# Altium project transmitter-d.PrjPcb
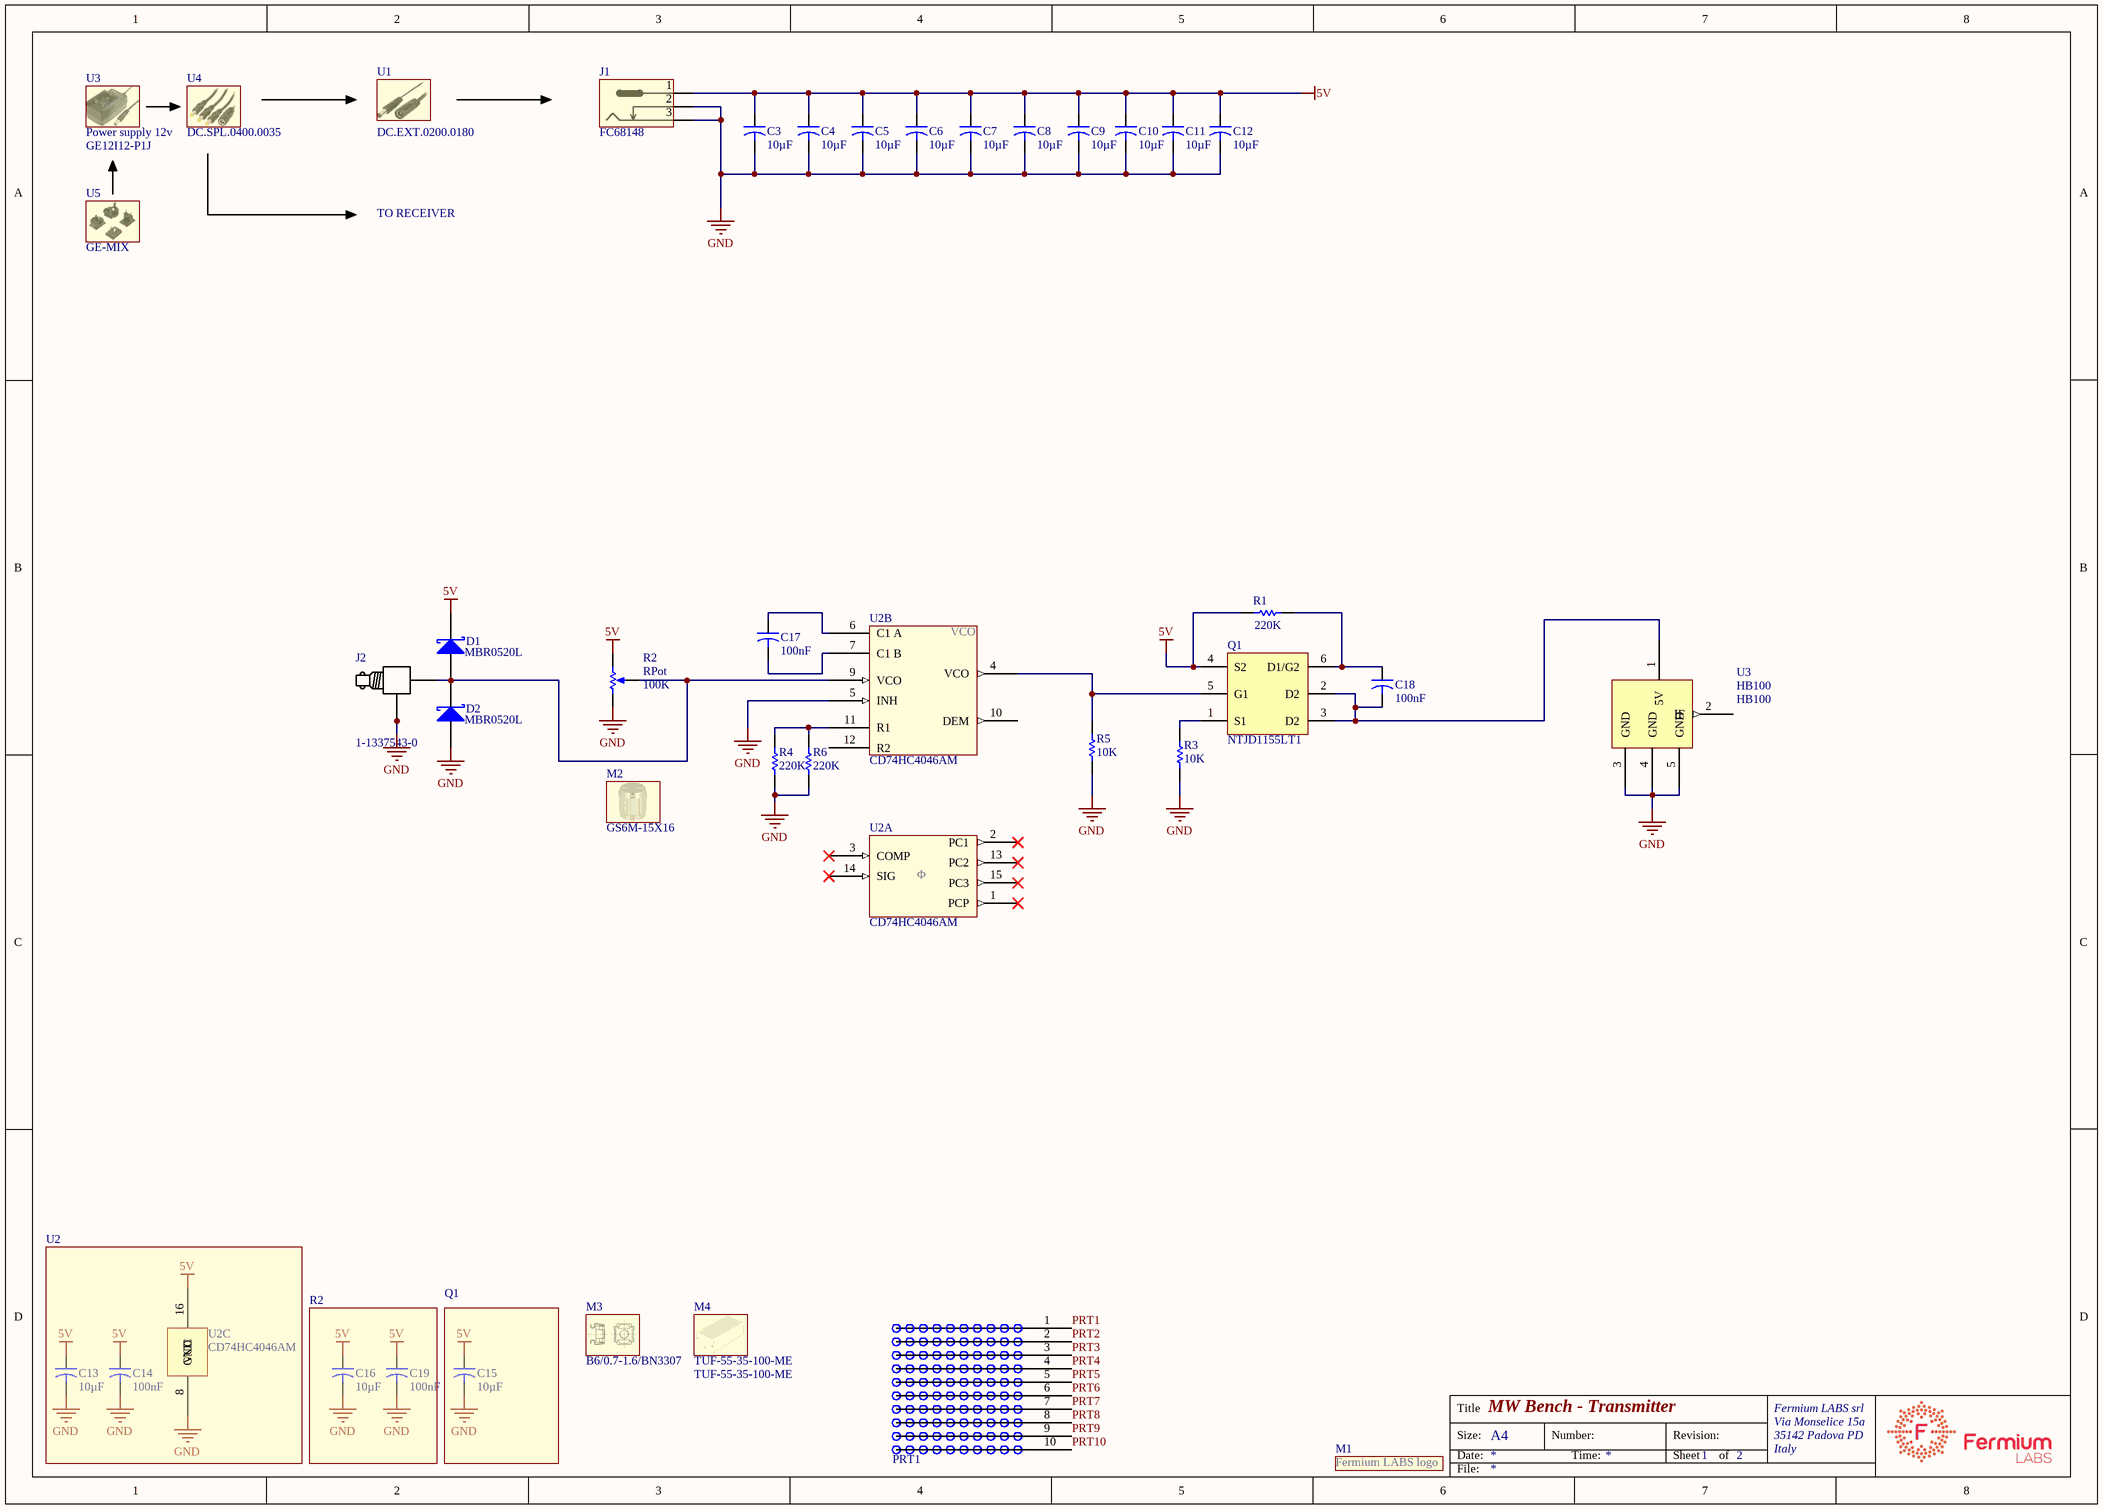
[diagram p0: transmitter-d.SchDoc]
1 sheet, 39 parts. Net scope: global (net labels, ports and power ports of the same name join across sheets).
Board file: transmitter-d.PcbDoc

## Sheet transmitter-d.SchDoc: MW Bench - Transmitter
size A3; Organization: Altium Limited; Address1: L3, 12a Rodborough Rd; Address2: Frenchs Forest; Address3: NSW; Address4: Australia 2086; SheetNumber: 1; SheetTotal: 2

### Parts
(Parts that share a designator on the sheet are numbered #1, #2 ... from top to bottom, then left to right.)
C3  Capacitance: 10µF  [CAP 1206/3216]
C4  Capacitance: 10µF  [CAP 1206/3216]
C5  Capacitance: 10µF  [CAP 1206/3216]
C6  Capacitance: 10µF  [CAP 1206/3216]
C7  Capacitance: 10µF  [CAP 1206/3216]
C8  Capacitance: 10µF  [CAP 1206/3216]
C9  Capacitance: 10µF  [CAP 1206/3216]
C10  Capacitance: 10µF  [CAP 1206/3216]
C11  Capacitance: 10µF  [CAP 1206/3216]
C12  Capacitance: 10µF  [CAP 1206/3216]
C13  Capacitance: 10µF  [CAP 1206/3216]
C14  Capacitance: 100nF  [CAP 0805/2012]
C15  Capacitance: 10µF  [CAP 1206/3216]
C16  Capacitance: 10µF  [CAP 1206/3216]
C17  Capacitance: 100nF  [CAP 0805/2012]
C18  Capacitance: 100nF  [CAP 0805/2012]
C19  Capacitance: 100nF  [CAP 0805/2012]
D1  Supplier Part Number 1: MBR0520L  [SOD123]
D2  Supplier Part Number 1: MBR0520L  [SOD123]
J1  Supplier Part Number 1: FC68148  [dc-jack]  (no BOM)
J2  Supplier Part Number 1: 1-1337543-0  [BNC-RA]
M1  fermiumlabs-logo  [frm-med]  (value not drawn)  (no BOM)
M2  knob  (value not drawn)  (mechanical)
M3  B6/0.7-1.6/BN3307  (mechanical)
M4  TUF-55-35-100-ME
PRT1  protoboard  [protoboard-half-inch]  (value not drawn)  (no BOM)
Q1  NTJD1155LT1  [ONSC-SC70-6-419B-02_W_V]
R1  value 220K  [RES 0805/2012]  (hidden comment: Res1)
R2  RPot  value 100K  [R16148-1A]
R3  value 10K  [RES 0805/2012]  (hidden comment: Res1)
R4  value 220K  [RES 0805/2012]  (hidden comment: Res1)
R5  value 10K  [RES 0805/2012]  (hidden comment: Res1)
R6  value 220K  [RES 0805/2012]  (hidden comment: Res1)
U1  DC.EXT.0200.0180  (mechanical)
U2  CD74HC4046AM  [SOIC16]  (parts A,B,C of 3)
U3#1  Power supply 12v  (mechanical)
U3#2  HB100  [HB100-buried]
U4  DC.SPL.0400.0035  (mechanical)
U5  Worldwide plugs for power supply  (value not drawn)  (mechanical)

### Blocks framed on the sheet
U2: C13 C14 U2
R2: C16 C19
Q1: C15

### Nets
5V: C3.1 C4.1 C5.1 C6.1 C7.1 C8.1 C9.1 C10.1 C11.1 C12.1 C13.1 C14.1 C15.1 C16.1 C19.1 D1.K J1.1 Q1.4(S2) R1.1 R2.2(BOT) U2.16(VCC)
GND: C3.2 C4.2 C5.2 C6.2 C7.2 C8.2 C9.2 C10.2 C11.2 C12.2 C13.2 C14.2 C15.2 C16.2 C19.2 D2.A J1.2 J1.3 J2.2(gnd) J2.A J2.B R2.1(TOP) R3.2 R4.1 R5.2 R6.1 U2.5(INH) U2.8(GND) U3#2.3(GND) U3#2.4(GND) U3#2.5(GND)
PRT1: PRT1.1
PRT2: PRT1.2
PRT3: PRT1.3
PRT4: PRT1.4
PRT5: PRT1.5
PRT6: PRT1.6
PRT7: PRT1.7
PRT8: PRT1.8
PRT9: PRT1.9
PRT10: PRT1.10
NetC17_1: C17.1 U2.6(C1_A)
NetC17_2: C17.2 U2.7(C1_B)
NetC18_1: C18.1 Q1.6(D1/G2) R1.2
NetC18_2: C18.2 Q1.2(D2) Q1.3(D2) U3#2.1(5V)
NetD1_A: D1.A D2.K J2.1 R2.3(TAP) U2.9(VCO)
NetQ1_1: Q1.1(S1) R3.1
NetQ1_5: Q1.5(G1) R5.1 U2.4(VCO)
NetR4_2: R4.2 R6.2 U2.11(R1)

Not connected (* = marked no-connect by the designer): U2 1(PCP)* 2(PC1)* 3(COMP)* 10(DEM) 12(R2) 13(PC2)* 14(SIG)* 15(PC3)*; U3#2 2(IF)

### Notes on the sheet
- TO RECEIVER
- Title
- Size:
- Date:
- A4
- Number:
- Time:
- Revision:
- Sheet
- of
- Fermium LABS srl
- Via Monselice 15a
- 35142 Padova PD
- Italy
- File:
- (in symbol CD74HC4046AM, part A) Φ
- (in symbol fermiumlabs-logo) Fermium LABS logo

### Library data of the parts
C3-C13 C15 C16 = Cap2: Capacitor; Manufacturer: SAMSUNG; Manufacturer Part Number: CL31A106KAHNNNE; Unit: pcs; SuppliedAmount: 0; MinAmount: 100; Capacitor type: ceramic; Capacitor kind: MLCC; Operating voltage: 25V; Dielectric: X5R; Tolerance: ±10%; Case - inch: 1206; Case - mm: 3216; Pads: 2 SMD; Published: 23-Sep-2002; PackageReference: CAPR5-4X5; Publisher: Altium Limited; PackageDescription: 1206; Supplier 1: TME; Supplier Part Number 1: CL31A106KAHNNNE; Category: 1206 MLCC SMD Capacitors; Stock 1: 279700; Pricing 1: 100=0.0248, 300=0.0203, 1000=0.0167, 2000=0.0131, 10000=0.0127 (EUR); Weight: 0.061; Multiples: 100; Mounting: SMD; Operating temperature: -55...85°C; Price Type: NET; ComponentLink1URL: http://static.tme.eu/products_pics/b/e/9/be9e0dd298dcf4979ea1dd3d226e0bfa/58780.jpg; ComponentLink1Description: http://static.tme.eu/products_pics/b/e/9/be9e0dd298dcf4979ea1dd3d226e0bfa/58780.jpg
C14 C17-C19 = Cap2: Capacitor; Manufacturer: YAGEO; Manufacturer Part Number: CC0805JRX7R9BB104; Unit: pcs; SuppliedAmount: 0; MinAmount: 100; Capacitor type: ceramic; Capacitor kind: MLCC; Operating voltage: 50V; Dielectric: X7R; Tolerance: ±5%; Case - inch: 0805; Case - mm: 2012; Pads: 2 SMD; Supplier 1: TME; Supplier Part Number 1: CC0805JRX7R9104; Category: 0805 MLCC SMD Capacitors; Stock 1: 89911; Pricing 1: 100=0.00613, 300=0.00464, 1000=0.00342, 4000=0.00284, 20000=0.00273 (EUR); Weight: 0.042; Multiples: 100; Mounting: SMD; Price Type: NET; ComponentLink1URL: http://static.tme.eu/products_pics/d/b/b/dbbd93eaf25225110ca26eb66da77328/58538.jpg; ComponentLink1Description: http://static.tme.eu/products_pics/d/b/b/dbbd93eaf25225110ca26eb66da77328/58538.jpg
D1 D2 = D Schottky: Schottky Diode; Manufacturer: FAIRCHILD SEMICONDUCTOR; Unit: pcs; SuppliedAmount: 0; MinAmount: 10; Multiples: 1; Diode type: Schottky rectifying; Off state voltage max.: 20V; Forward voltage at If: 390mV; Load current: 500mA; Pads: 2 SMD; Published: 8-Jun-2000; LatestRevisionDate: 17-Jul-2002; LatestRevisionNote: Re-released for DXP Platform.; PackageReference: SMB; Publisher: Altium Limited; PackageDescription: DO-214-AA/SMB; 2 C-Bend Leads; Body 5.3 x 3.6 mm, inc. leads (LxW); Code_JEDEC: DO-214-AA; Supplier 1: TME; Manufacturer Part Number: MBR0520L; Category: SMD Schottky Diodes; Stock 1: 24595; Pricing 1: 10=0.0403, 50=0.0376, 250=0.0333, 1000=0.03, 3000=0.0281 (EUR); Weight: 0.032; Case: SOD123; Mounting: SMD; Price Type: NET; ComponentLink1URL: http://static.tme.eu/products_pics/e/d/b/edbd030cb344fc64745afa0f91101952/285567.jpg; ComponentLink1Description: http://static.tme.eu/products_pics/e/d/b/edbd030cb344fc64745afa0f91101952/285567.jpg
J1 = jackdc: Manufacturer: CLIFF; Manufacturer Part Number: DC-10A FC68148; Unit: pcs; SuppliedAmount: 0; MinAmount: 1; Connector: socket; Connector type: DC supply; Contact size: 5,5/2,1mm; Plug outside diameter: 5.5mm; Plug inside diameter: 2.1mm; Connector variant: with on/off switch; Electrical mounting: soldering; Rated current: 5A; Rated voltage: 12V DC; Spatial orientation: angled 90°; Pads: 3 THT; Supplier 1: TME; Category: DC power connectors; Stock 1: 20287; Pricing 1: 1=0.4194, 20=0.3065, 100=0.2581, 500=0.2258 (USD); Weight: 1.733; Multiples: 1; Package type: in bulk; Price Type: NET; ComponentLink1URL: http://static.tme.eu/products_pics/f/8/e/f8eb2e1bea4ffe6692f5958f8ef9edd4/323250.jpg; ComponentLink1Description: http://static.tme.eu/products_pics/f/8/e/f8eb2e1bea4ffe6692f5958f8ef9edd4/323250.jpg
J2 = BNC-PCB-RA: connector bnc; Manufacturer: TE CONNECTIVITY; Unit: pcs; SuppliedAmount: 0; MinAmount: 1; Connector: socket; Connector variant: insulated; Spatial orientation: angled 90°; Wave impedance: 50Ω; Electrical mounting: THT; Mechanical mounting: on PCBs; Insulator material: polyester; Pads: 4 THT; Supplier 1: TME; Manufacturer Part Number: 1-1337543-0; Category: BNC connectors; Stock 1: 44; Pricing 1: 1=1.22, 25=1.1, 100=0.98, 1000=0.86 (EUR); Weight: 13.22; Multiples: 1; Connector type: BNC; Contact plating: gold plated; Price Type: NET; ComponentLink1URL: http://static.tme.eu/products_pics/6/3/2/63240353f8a8790dbe8f7bd93b014c1a/378606.jpg; ComponentLink1Description: http://static.tme.eu/products_pics/6/3/2/63240353f8a8790dbe8f7bd93b014c1a/378606.jpg
M2 = GS6M-15X16: Supplier 1: TME; Supplier Part Number 1: GS6M-15X16
Q1 = NTJD1155LT1: Power MOSFET, 8 V, +/- 1.3 A, High Side Load Switch with Level-Shift, P-Channel, 6-Pin SC70, Tape and Reel; Manufacturer: On Semiconductor; Manufacturer Part Number: NTJD1155LT1G; Channel Polarity: P Channel; Configuration: Dual; ID Max (A): 1.3; V(BR)DSS Min (V): 8; VGS(th) Max (V): 1; Max Power Dissipation: 400mW; Rds On Max: 175mR; Gate to Source Voltage (Vgs): 1V; Drain to Source Resistance: 260mR; Continuous Drain Current (ID): 1.3A; Drain to Source Breakdown Voltage: -8V; Current Rating: 630mA; Number of Elements: 2; On-State Resistance: 130MR; DatasheetVersion: Rev. 5; PackageVersion: Rev. W; PackageReference: SC70-6-419B-02_W; PackageDescription: 6-Pin Small Outline Transistor, Body 2 x 1.25 mm, Pitch 0.65 mm; Package Type: SC-88-6 / SC-70-6 / SOT-363-6; Packing: Tape and Reel; Mounting Technology: Surface Mount; PartNumber: NTJD1155LT1; ComponentLink1Description: Manufacturer URL; ComponentLink1URL: http://www.onsemi.com/; ComponentLink2Description: Datasheet; ComponentLink2URL: http://www.onsemi.com/pub_link/Collateral/NTJD1155L-D.PDF; ComponentLink3Description: Package Specification; ComponentLink3URL: http://www.onsemi.com/pub_link/Collateral/SMF05C-D.PDF; Supplier 1: TME; Supplier Part Number 1: NTJD1155LT1G; Stock 1: 2800; Pricing 1: 5=0.145, 25=0.1248, 100=0.1003, 500=0.0901, 3000=0.0841 (USD); Case/Package: SOT-363-6; Number of Pins: 6; Min Operating Temperature: -55°C; Max Operating Temperature: 150°C; Package Quantity: 3000; Packaging: Tape and Reel; Power Dissipation: 400mW; Element Configuration: Dual; Threshold Voltage: 1V; Length: 2.2mm; Height: 1mm; Width: 1.35mm; Radiation Hardening: No; Lead Free: Lead Free; REACH SVHC: No SVHC; ComponentLink4URL: https://datasheet.ciiva.com/30480/0900766b81206044-30480067.pdf; ComponentLink4Description: https://datasheet.ciiva.com/30480/0900766b81206044-30480067.pdf; ComponentLink5URL: https://datasheet.ciiva.com/11168/ntjd1155l-d-11168370.pdf; ComponentLink5Description: https://datasheet.ciiva.com/11168/ntjd1155l-d-11168370.pdf; ComponentLink6URL: https://datasheet.ciiva.com/929/ntjd1155l-d-929102.pdf; ComponentLink6Description: https://datasheet.ciiva.com/929/ntjd1155l-d-929102.pdf; ComponentLink7URL: https://datasheet.ciiva.com/929/ntjd1155l-d-929103.pdf; ComponentLink7Description: https://datasheet.ciiva.com/929/ntjd1155l-d-929103.pdf; ComponentLink8URL: https://datasheet.ciiva.com/929/ntjd1155l-d-929101.pdf; ComponentLink8Description: https://datasheet.ciiva.com/929/ntjd1155l-d-929101.pdf; ComponentLink9URL: https://datasheet.ciiva.com/11168/ntjd1155l-d-11168373.pdf; ComponentLink9Description: https://datasheet.ciiva.com/11168/ntjd1155l-d-11168373.pdf; ComponentLink10URL: https://datasheet.ciiva.com/26144/ntjd1155l-d-26144501.pdf; ComponentLink10Description: https://datasheet.ciiva.com/26144/ntjd1155l-d-26144501.pdf
R1 R4 R6 = Res1: Resistor; Manufacturer: Royal Electronic Factory; Manufacturer Part Number: 0805S8J0224T5E; Supplier 1: TME; Supplier Part Number 1: SMD0805-220K; Stock 1: 102100; Pricing 1: 100=0.0065, 1000=0.0025, 5000=0.0009, 15000=0.0008, 50000=0.0008 (USD)
R2 = RPot: Potentiometer; Supplier 1: TME; Supplier Part Number 1: R16148-1A-2-A100K
R3 R5 = Res1: Resistor; Manufacturer: Royal Electronic Factory; Manufacturer Part Number: 0805S8J0103T5E; Supplier 1: TME; Supplier Part Number 1: SMD0805-10K; Stock 1: 1600500; Pricing 1: 100=0.0065, 1000=0.0023, 5000=0.0008, 15000=0.0008, 50000=0.0008 (USD)
U3#1 = GE12I12-P1J: Supplier 1: TME; Supplier Part Number 1: GE12I12-P1J
U3#2 = HB100: Manufacturer: China unspecified; Manufacturer Part Number: HB100; Supplier 1: Alibaba; Supplier Part Number 1: HB100
U5 = GE-MIX: Supplier 1: TME; Supplier Part Number 1: GE-MIX
M3 = B6/0.7-1.6/BN3307: Supplier 1: TME; Supplier Part Number 1: B6/0.7-1.6/BN3307
M4 = TUF-55-35-100-ME: Supplier 1: TME; Supplier Part Number 1: TUF-55-35-100-ME
U1 = DC.EXT.0200.0180: Supplier 1: TME; Supplier Part Number 1: DC.EXT.0200.0180
U2 = CD74HC4046AM: Supplier 1: TME; Supplier Part Number 1: CD74HC4046AM
U4 = DC.SPL.0400.0035: Supplier 1: TME; Supplier Part Number 1: DC.SPL.0400.0035